# Altium project EE209_Prototype.PrjPcb
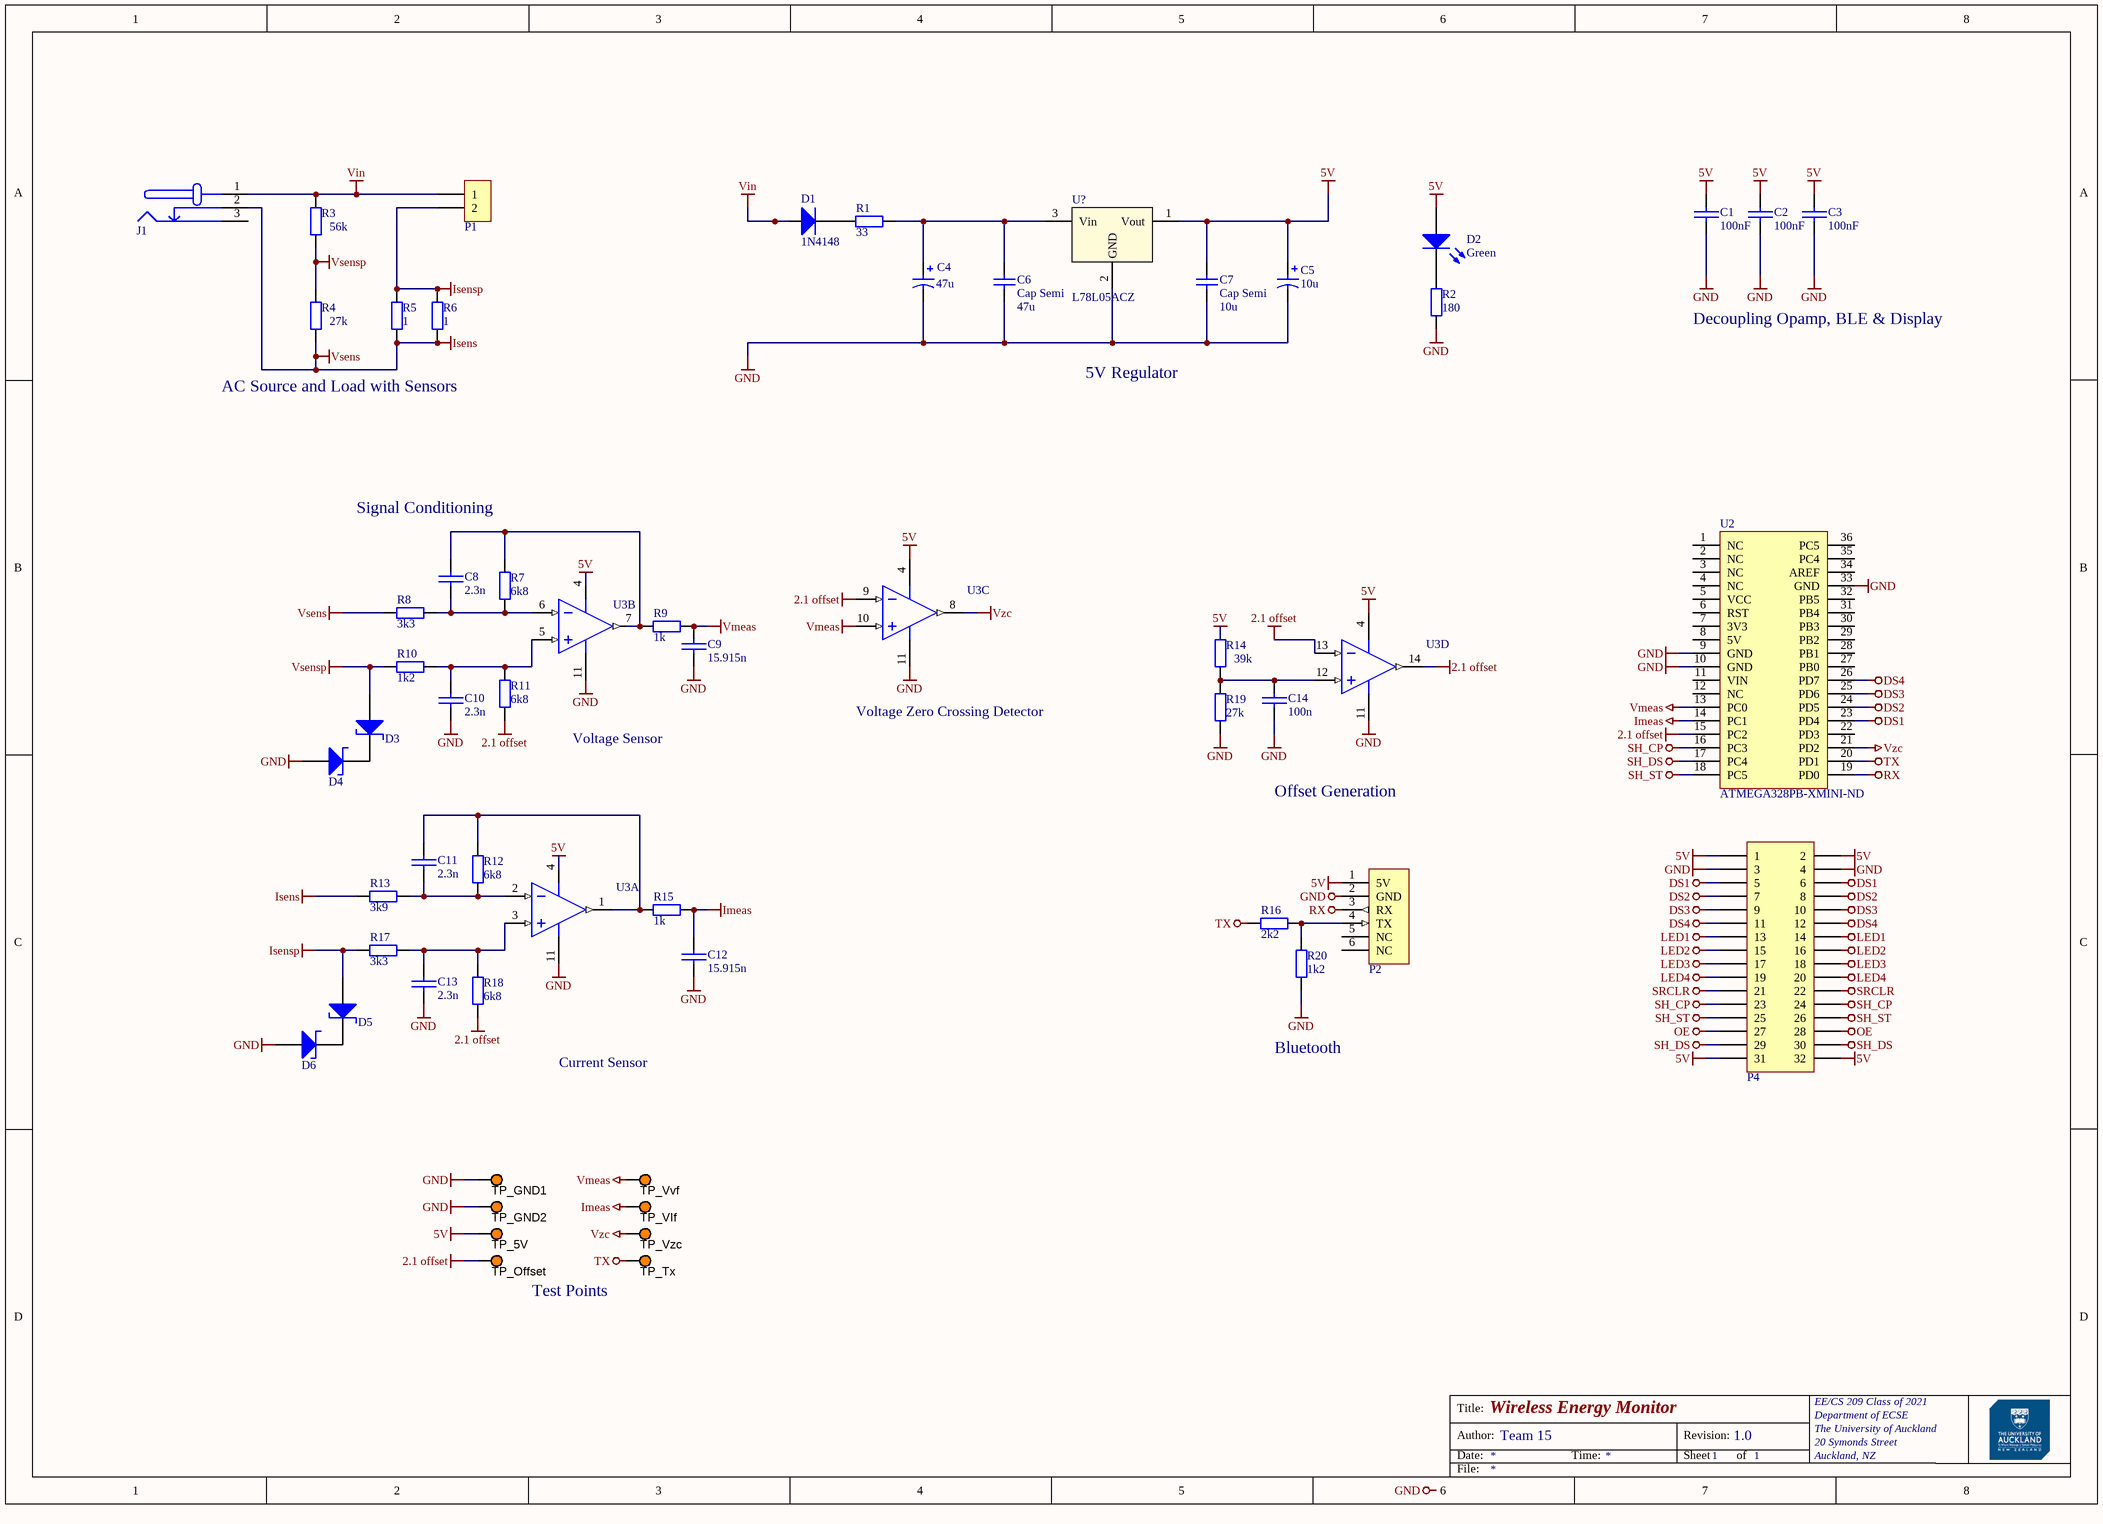
[diagram p0: EE209_Schematic.SchDoc]
1 sheet, 55 parts. Net scope: global (net labels, ports and power ports of the same name join across sheets).
Board file: EE209_PCB.PcbDoc

## Sheet EE209_Schematic.SchDoc: Wireless Energy Monitor
size A3; Author: Team 15; Organization: EE/CS 209 Class of 2021; Address1: Department of ECSE; Address2: The University of Auckland; Address3: 20 Symonds Street; Address4: Auckland, NZ; Revision: 1.0; SheetNumber: 1; SheetTotal: 1

### Parts
C1  100nF  [CCAP-5P0]
C2  100nF  [CCAP-5P0]
C3  100nF  [CCAP-5P0]
C4  47u  [CAP-RAD-2.5mm Pitch]
C5  10u  [CAP-RAD-2.5mm Pitch]
C6  Cap Semi  value 47u  [C1206]
C7  Cap Semi  value 10u  [C1206]
C8  2.3n  [CCAP-5P0]
C9  15.915n  [CCAP-5P0]
C10  2.3n  [CCAP-5P0]
C11  2.3n  [CCAP-5P0]
C12  15.915n  [CCAP-5P0]
C13  2.3n  [CCAP-5P0]
C14  100n  [CCAP-5P0]
D1  1N4148  [SOD123]
D2  Green  [LED]
D3  BZX79-CXVX  [AXIAL-Zener-0.4]  (value not drawn)
D4  BZX79-CXVX  [AXIAL-Zener-0.4]  (value not drawn)
D5  BZX79-CXVX  [AXIAL-Zener-0.4]  (value not drawn)
D6  BZX79-CXVX  [AXIAL-Zener-0.4]  (value not drawn)
J1  DC barrel jack  [AC-Socket]  (value not drawn)
P1  Dual Banana Plugs  [Dual Banana Plug]  (value not drawn)
P2  BLE Module Header  [HM10_HDR1X6]  (value not drawn)
P4  Display  [Display]  (value not drawn)
R1  33  [AXIAL-0.4]
R2  180  [AXIAL-0.4]
R3  56k  [AXIAL-0.4]
R4  27k  [AXIAL-0.4]
R5  1  [AXIAL-0.4]
R6  1  [AXIAL-0.4]
R7  6k8  [AXIAL-0.4]
R8  3k3  [AXIAL-0.4]
R9  1k  [AXIAL-0.4]
R10  1k2  [AXIAL-0.4]
R11  6k8  [AXIAL-0.4]
R12  6k8  [AXIAL-0.4]
R13  3k9  [AXIAL-0.4]
R14  39k  [AXIAL-0.4]
R15  1k  [AXIAL-0.4]
R16  2k2  [AXIAL-0.4]
R17  3k3  [AXIAL-0.4]
R18  6k8  [AXIAL-0.4]
R19  27k  [AXIAL-0.4]
R20  1k2  [AXIAL-0.4]
TP_5V  5003  [TP_TH]  (value not drawn)
TP_GND1  5003  [TP_TH]  (value not drawn)
TP_GND2  5003  [TP_TH]  (value not drawn)
TP_Offset  5003  [TP_TH]  (value not drawn)
TP_Tx  5003  [TP_TH]  (value not drawn)
TP_VIf  5003  [TP_TH]  (value not drawn)
TP_Vvf  5003  [TP_TH]  (value not drawn)
TP_Vzc  5003  [TP_TH]  (value not drawn)
U2  Supplier Part Number 1: ATMEGA328PB-XMINI-ND  [ATmeg328P Xplained]  (hidden comment: ATmega328PB Xplained Mini Header)
U3  LM324  [DIP-14]  (value not drawn)  (parts A,B,C,D of 4)
U?  L78L05ACZ  [TO-92]

### Nets
2.1 offset: R11.1 R18.1 TP_Offset.1 U2.15(PC2) U3.9(VINC-) U3.13(VIND-) U3.14(VOUTD)
5V: C1.1 C2.1 C3.1 C5.1 C7.2 D2.1(A) P2.1(5V) P4.1 P4.2 P4.31 P4.32 R14.1 TP_5V.1 U3.4(VDD) U?.1(Vout)
DS1: P4.5 P4.6 U2.23(PD4)
DS2: P4.7 P4.8 U2.24(PD5)
DS3: P4.9 P4.10 U2.25(PD6)
DS4: P4.11 P4.12 U2.26(PD7)
GND: C1.2 C2.2 C3.2 C4.2 C5.2 C6.1 C7.1 C9.2 C10.2 C12.2 C13.2 C14.2 D4.1(A) D6.1(A) P2.2(GND) P4.3 P4.4 R2.2 R19.2 R20.2 TP_GND1.1 TP_GND2.1 U2.9(GND) U2.10(GND) U2.33(GND) U3.11(VSS) U?.2(GND)
Imeas: C12.1 R15.2 TP_VIf.1 U2.14(PC1)
Isens: J1.2(GND_ALT) R4.1 R5.1 R6.1 R8.2 R13.2  [also labelled Vsens]
Isensp: D5.1(A) P1.2 R5.2 R6.2 R17.1
LED1: P4.13 P4.14
LED2: P4.15 P4.16
LED3: P4.17 P4.18
LED4: P4.19 P4.20
OE: P4.27 P4.28
RX: P2.3(RX) U2.19(PD0)
SH_CP: P4.23 P4.24 U2.16(PC3)
SH_DS: P4.29 P4.30 U2.17(PC4)
SH_ST: P4.25 P4.26 U2.18(PC5)
SRCLR: P4.21 P4.22
TX: R16.1 TP_Tx.1 U2.20(PD1)
Vin: D1.1(A) J1.1(VCC) P1.1 R3.2
Vmeas: C9.1 R9.2 TP_Vvf.1 U2.13(PC0) U3.10(VINC+)
Vsensp: D3.1(A) R3.1 R4.2 R10.1
Vzc: TP_Vzc.1 U2.21(PD2) U3.8(VOUTC)
NetC4_1: C4.1 C6.2 R1.1 U?.3(Vin)
NetC8_1: C8.1 R7.1 R9.1 U3.7(VOUTB)
NetC8_2: C8.2 R7.2 R8.1 U3.6(VINB-)
NetC10_1: C10.1 R10.2 R11.2 U3.5(VINB+)
NetC11_1: C11.1 R12.1 R15.1 U3.1(VOUTA)
NetC11_2: C11.2 R12.2 R13.1 U3.2(VINA-)
NetC13_1: C13.1 R17.2 R18.2 U3.3(VINA+)
NetC14_1: C14.1 R14.2 R19.1 U3.12(VIND+)
NetD1_2: D1.2(K) R1.2
NetD2_2: D2.2(K) R2.1
NetD3_2: D3.2(K) D4.2(K)
NetD5_2: D5.2(K) D6.2(K)
NetP2_4: P2.4(TX) R16.2 R20.1

Not connected (* = marked no-connect by the designer): J1 3(GND); P2 5(NC) 6(NC); U2 1(NC) 2(NC) 3(NC) 4(NC) 5(VCC) 6(RST) 7(3V3) 8(5V) 11(VIN) 12(NC) 22(PD3) 27(PB0) 28(PB1) 29(PB2) 30(PB3) 31(PB4) 32(PB5) 34(AREF) 35(PC4) 36(PC5)

### Notes on the sheet
- 5V Regulator
- Decoupling Opamp, BLE & Display
- AC Source and Load with Sensors
- Signal Conditioning
- Voltage Zero Crossing Detector
- Voltage Sensor
- Offset Generation
- Bluetooth
- Current Sensor
- (near TP_Tx) Test Points
- Labels drawn without touching a wire or pin: GND
- Title:
- Author:
- Date:
- Time:
- Revision:
- Sheet
- of
- File:

### Library data of the parts
C1-C3 C8-C14 = CerCap_TH_5P0: TH ceramic capacitor with 5mm pitch
  C1-C3: Value: 100nF
  C8 C10 C11 C13: Value: 2.3n
  C9 C12: Value: 15.915n
  C14: Value: 100n
C4 C5 = ElecCap_TH_2P0: Electrolytic capacitor with radial package, 2mm pitch and 5.2mm diameter; Published: 8-Jun-2000; LatestRevisionDate: 17-Jul-2002; LatestRevisionNote: Re-released for DXP Platform.; PackageReference: POLAR0.8; Publisher: Altium Limited; PackageDescription: Polarized Capacitor; 2 Leads
  C4: Value: 47u
  C5: Value: 10u
C6 C7 = Cap Semi: Capacitor (Semiconductor SIM Model); Published: 8-Jun-2000; LatestRevisionDate: 29-May-2009; LatestRevisionNote: IPC-7351 Footprint Added.; PackageReference: C1206; Publisher: Altium Limited; PackageDescription: Chip Capacitor
D1 = ES1H_SMT_DO214: 1N4148 100V 200mA SOD-123 diode; Manufacturer: ON Semiconductor; Manufacturer Part Number: 1N4148TR; Diode Type: Standard; Speed: Small Signal =< 200mA (Io), Any Speed; Capacitance @ Vr, F: 4pF @ 0V, 1MHz; Supplier 1: Digi-Key; RoHS: RoHS Compliant; Category: Discrete Semiconductor Products; Stock 1: 1658049; Pricing 1: 1=0.16, 10=0.109, 100=0.0592, 500=0.03648, 1000=0.02488 (NZD); Part Status: Active; Current - Average Rectified (Io): 200mA; Mounting Type: Through Hole; Package / Case: DO-204AH, DO-35, Axial; Supplier Device Package: DO-35; Operating Temperature - Junction: -65°C ~ 175°C; Base Part Number: 1N4148; ComponentLink1URL: https://www.fairchildsemi.com/datasheets/1N/1N914.pdf; ComponentLink1Description: https://www.fairchildsemi.com/datasheets/1N/1N914.pdf; Supplier Part Number 1: 1N4148FSCT-ND
D2 = LED_TH_2P54: Typical throughole GaAs LED with 2.54mm pitch; Manufacturer: Generic Components; Class I: Optoelectronic; Published: 8-Jun-2000; Revision: July-2002: Re-released for DXP Platform.; Publisher: Altium Limited; Class II: LED; Value: Green
D3-D6 = Zener_TH_4AX0: Axial zener diode BZX79 series; Manufacturer: Nexperia USA Inc.; Manufacturer Part Number: BZX79-C4V7,143; Tolerance: ±5%; Supplier 1: Digi-Key; RoHS: RoHS Compliant; Category: Discrete Semiconductor Products; Stock 1: 8933; Pricing 1: 1=0.23, 10=0.206, 100=0.1123, 500=0.06912, 1000=0.04714 (NZD); Packaging: Cut Tape (CT); Part Status: Active; Operating Temperature: -65°C ~ 200°C; Mounting Type: Through Hole; Package / Case: DO-204AH, DO-35, Axial; Supplier Device Package: DO-35; ComponentLink1URL: https://assets.nexperia.com/documents/data-sheet/BZX79.pdf; ComponentLink1Description: https://assets.nexperia.com/documents/data-sheet/BZX79.pdf; Supplier Part Number 1: 1727-1864-1-ND
J1 = AC_Input: DC barrel jack connection to AC source; Value: socket
P1 = AC_Output: Dual banana plugs connection to the AC load; LatestRevisionDate: 17-Jul-2002; LatestRevisionNote: Re-released for DXP Platform.; Publisher: Altium Limited
P2 = BLEModule_TH: 2.54mm pitch 6-pin header for BLE module; LatestRevisionDate: 17-Jul-2002; LatestRevisionNote: Re-released for DXP Platform.; Publisher: Altium Limited
P4 = Display: 16-Pin Header Connecting Display
R1-R20 = Res_TH_0AX4: Through hole resistor; Published: 8-Jun-2000; LatestRevisionDate: 17-Jul-2002; LatestRevisionNote: Re-released for DXP Platform.; PackageReference: AXIAL-0.4; Publisher: Altium Limited; ComponentLink1Description: http://www.royalohm.com/pdf/product2017/PrecisionMetalMF.pdf
  R1: Value: 33
  R2: Value: 180
  R3: Value: 56k
  R4 R19: Value: 27k
  R5 R6: Value: 1
  R7 R11 R12 R18: Value: 6k8
  R8 R17: Value: 3k3
  R9 R15: Value: 1k
  R10 R20: Value: 1k2
  R13: Value: 3k9
  R14: Value: 39k
  R16: Value: 2k2
TP_5V TP_GND1 TP_GND2 TP_Offset TP_Tx TP_VIf TP_Vvf TP_Vzc = TestPoint: Test Point, Orange, 1-Pin THD, RoHS; Peak Reverse Current: 600 uA; Forward Current: 3 A; Max Surge Current: 80 A; Forward Voltage: 1.08 V; Max Operating Temperature: 150 degC; PackageReference: 5003; Pins: 2; ComponentLink2URL: http://keyelco.com/userAssets/file/M65p56.pdf; PackageDescription: 1-Pin Through Hole Device, Dia 2.54 mm; Weight: 0.01 lb; Diameter: 5.3 mm; Mount: Through Hole; Package Quantity: 500; Packaging: Bulk; Min Operating Temperature: -65 degC; ComponentLink1Description: Manufacturer URL; Height: 0.25 inch; ComponentLink1URL: http://www.keyelco.com/; ComponentLink2Description: Datasheet; Width: 0.25 inch; REACH SVHC: No SVHC; RoHSCompliant: true; Radiation Hardening: No; Length: 9.5 mm; DatasheetVersion: Jun-15
U2 = ATmega328PBXplained_TH: Dual 18-pin headers connecting to ATmega328PB Xplained Mini; Manufacturer: Microchip Technology; Manufacturer Part Number: ATMEGA328PB-XMINI; Board Type: Evaluation Platform; Core Processor: AVR; Platform: ATmega328P Xplained Mini; Contents: Board(s); Supplier 1: Digi-Key; RoHS: RoHS Compliant; Category: Development Boards, Kits, Programmers; Stock 1: 454; Pricing 1: 1=15.11 (NZD); Part Status: Active; Type: MCU 8-Bit; Operating System: -; For Use With/Related Products: ATmega328P; Mounting Type: Fixed; ComponentLink1URL: http://www.microchip.com/mymicrochip/filehandler.aspx?ddocname=en589665; ComponentLink1Description: http://www.microchip.com/mymicrochip/filehandler.aspx?ddocname=en589665
U3 = LM324N_TH_DIP16: IC OPAMP GP 14DIP; Manufacturer: ON Semiconductor; Manufacturer Part Number: LM324N; Amplifier Type: General Purpose; Current - Supply: 1mA; Voltage - Supply, Single/Dual (±): 3 V ~ 32 V, ±1.5 V ~ 16 V; Supplier 1: Digi-Key; RoHS: RoHS Compliant; Category: Integrated Circuits (ICs); Stock 1: 2900; Pricing 1: 1=0.9, 10=0.775, 100=0.5789, 500=0.45482, 1000=0.35145 (NZD); Packaging: Tube; Part Status: Active; Output Type: -; Slew Rate: -; Operating Temperature: 0°C ~ 70°C; Mounting Type: Through Hole; Package / Case: 14-DIP (0.300", 7.62mm); Supplier Device Package: 14-DIP; Base Part Number: LM324; ComponentLink1URL: https://www.fairchildsemi.com/datasheets/LM/LM2902.pdf; ComponentLink1Description: https://www.fairchildsemi.com/datasheets/LM/LM2902.pdf; Supplier Part Number 1: LM324NFS-ND
U? = L78L05_TH_TO92: Voltage Regulator 5V; Manufacturer: ON Semiconductor; Manufacturer Part Number: LM78L05ACZX; Output Configuration: Positive; Output Type: Fixed; Voltage - Input (Max): 30V; Current - Output: 100mA; PSRR: 80dB (120Hz); Protection Features: Over Temperature, Short Circuit; Supplier 1: Digi-Key; RoHS: RoHS Compliant; Category: Integrated Circuits (ICs); Stock 1: 7782; Pricing 1: 1=0.69, 10=0.517, 100=0.3226, 500=0.2207, 1000=0.16976 (NZD); Packaging: Cut Tape (CT); Part Status: Active; Voltage - Output (Min/Fixed): 5V; Voltage - Output (Max): -; Voltage Dropout (Max): -; Control Features: -; Operating Temperature: -40°C ~ 125°C; Mounting Type: Through Hole; Package / Case: TO-226-3, TO-92-3 (TO-226AA) (Formed Leads); Supplier Device Package: TO-92-3; Base Part Number: LM78L05; ComponentLink1URL: https://www.fairchildsemi.com/datasheets/MC/MC78L05A.pdf; ComponentLink1Description: https://www.fairchildsemi.com/datasheets/MC/MC78L05A.pdf; Supplier Part Number 1: LM78L05ACZXCT-ND